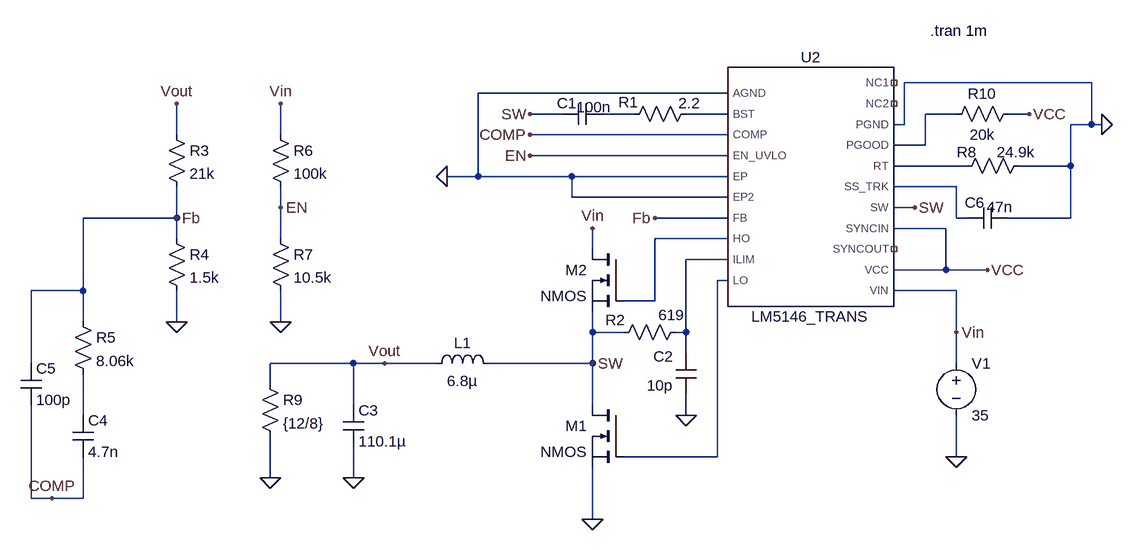
[diagram p0: schematic LM5146.asc]
LM5146.asc, the LTspice schematic file:
Version 4.1
SHEET 1 1416 724
WIRE 592 32 304 32
WIRE 32 48 -352 48
WIRE -224 80 -272 80
WIRE -112 80 -160 80
WIRE 32 80 -32 80
WIRE 384 80 336 80
WIRE 496 80 464 80
WIRE 304 96 304 32
WIRE 304 96 288 96
WIRE 592 96 592 32
WIRE 592 96 560 96
WIRE 608 96 592 96
WIRE -816 112 -816 64
WIRE -656 112 -656 64
WIRE 32 112 -272 112
WIRE 336 128 336 80
WIRE 336 128 288 128
WIRE 32 144 -272 144
WIRE 400 160 288 160
WIRE 560 160 560 96
WIRE 560 160 480 160
WIRE -352 176 -352 48
WIRE -352 176 -400 176
WIRE -208 176 -352 176
WIRE 32 176 -208 176
WIRE 384 192 288 192
WIRE -208 208 -208 176
WIRE 32 208 -208 208
WIRE -656 224 -656 192
WIRE 320 224 288 224
WIRE -816 240 -816 192
WIRE -816 240 -960 240
WIRE 32 240 -80 240
WIRE 384 240 384 192
WIRE 400 240 384 240
WIRE 560 240 560 160
WIRE 560 240 464 240
WIRE 368 256 288 256
WIRE -816 272 -816 240
WIRE -656 272 -656 224
WIRE 32 272 -80 272
WIRE -176 288 -176 256
WIRE 32 304 -32 304
WIRE 368 320 368 256
WIRE 368 320 288 320
WIRE 432 320 368 320
WIRE 32 336 16 336
WIRE -960 352 -960 240
WIRE -960 352 -1040 352
WIRE 384 352 288 352
WIRE -80 368 -80 272
WIRE -80 368 -128 368
WIRE -960 400 -960 352
WIRE -816 400 -816 352
WIRE -656 400 -656 352
WIRE -176 416 -176 384
WIRE -128 416 -176 416
WIRE -32 416 -32 304
WIRE -32 416 -48 416
WIRE 384 416 384 352
WIRE -32 448 -32 416
WIRE -1040 464 -1040 352
WIRE -544 464 -672 464
WIRE -496 464 -544 464
WIRE -416 464 -496 464
WIRE -176 464 -176 416
WIRE -176 464 -336 464
WIRE 384 464 384 416
WIRE -672 496 -672 464
WIRE -544 528 -544 464
WIRE -176 528 -176 464
WIRE -960 544 -960 480
WIRE -32 544 -32 512
WIRE 16 608 16 336
WIRE 16 608 -128 608
WIRE 384 608 384 544
WIRE -672 640 -672 576
WIRE -544 640 -544 592
WIRE -1040 672 -1040 528
WIRE -1008 672 -1040 672
WIRE -960 672 -960 608
WIRE -960 672 -1008 672
WIRE -176 704 -176 624
FLAG -400 176 0
FLAG 608 96 0
FLAG -272 80 SW
FLAG 432 320 VCC
FLAG 384 608 0
FLAG 384 416 Vin
FLAG -176 256 Vin
FLAG -176 704 0
FLAG -32 544 0
FLAG -544 640 0
FLAG -496 464 Vout
FLAG -816 400 0
FLAG -816 64 Vout
FLAG -816 240 Fb
FLAG -80 240 Fb
FLAG -1008 672 COMP
FLAG -272 112 COMP
FLAG -656 400 0
FLAG -656 64 Vin
FLAG -656 224 EN
FLAG -272 144 EN
FLAG 320 224 SW
FLAG -176 464 SW
FLAG -672 640 0
FLAG 496 80 VCC
SYMBOL res -16 64 R90
WINDOW 0 13 105 VBottom 2
WINDOW 3 -16 11 VTop 2
SYMATTR InstName R1
SYMATTR Value 2.2
SYMBOL cap -160 64 R90
WINDOW 0 15 55 VBottom 2
WINDOW 3 -10 14 VTop 2
SYMATTR InstName C1
SYMATTR Value 100n
SYMBOL voltage 384 448 R0
WINDOW 123 0 0 Left 0
WINDOW 39 0 0 Left 0
SYMATTR InstName V1
SYMATTR Value 35
SYMBOL nmos -128 528 M0
SYMATTR InstName M1
SYMBOL nmos -128 288 M0
SYMATTR InstName M2
SYMBOL res -32 400 R90
WINDOW 0 13 109 VBottom 2
WINDOW 3 -26 22 VTop 2
SYMATTR InstName R2
SYMATTR Value 619
SYMBOL cap -48 448 R0
WINDOW 0 -34 5 Left 2
WINDOW 3 -44 50 Left 2
SYMATTR InstName C2
SYMATTR Value 10p
SYMBOL ind -432 480 R270
WINDOW 0 32 56 VTop 2
WINDOW 3 5 56 VBottom 2
SYMATTR InstName L1
SYMATTR Value 6.8µ
SYMBOL cap -560 528 R0
SYMATTR InstName C3
SYMATTR Value 110.1µ
SYMBOL res -832 96 R0
SYMATTR InstName R3
SYMATTR Value 21k
SYMBOL res -832 256 R0
SYMATTR InstName R4
SYMATTR Value 1.5k
SYMBOL res -976 384 R0
SYMATTR InstName R5
SYMATTR Value 8.06k
SYMBOL cap -976 544 R0
SYMATTR InstName C4
SYMATTR Value 4.7n
SYMBOL cap -1056 464 R0
SYMATTR InstName C5
SYMATTR Value 100p
SYMBOL res -672 96 R0
SYMATTR InstName R6
SYMATTR Value 100k
SYMBOL res -672 256 R0
SYMATTR InstName R7
SYMATTR Value 10.5k
SYMBOL res 496 144 R90
WINDOW 0 10 96 VBottom 2
WINDOW 3 -21 20 VTop 2
SYMATTR InstName R8
SYMATTR Value 24.9k
SYMBOL cap 464 224 R90
WINDOW 0 8 52 VBottom 2
WINDOW 3 -16 13 VTop 2
SYMATTR InstName C6
SYMATTR Value 47n
SYMBOL res -688 480 R0
SYMATTR InstName R9
SYMATTR Value {12/8}
SYMBOL LM5146 160 192 R0
SYMATTR InstName U2
SYMBOL res 480 64 R90
WINDOW 0 0 56 VBottom 2
WINDOW 3 32 56 VTop 2
SYMATTR InstName R10
SYMATTR Value 20k
TEXT 344 -48 Left 2 !.tran 1m

The netlist it stands for:
* LM5146.asc
R1 N002 N001 2.2
C1 N001 SW 100n
V1 Vin 0 35
M1 SW N008 0 0 NMOS
M2 Vin N006 SW SW NMOS
R2 N007 SW 619
C2 N007 0 10p
L1 Vout SW 6.8µ
C3 Vout 0 110.1µ
R3 Vout Fb 21k
R4 Fb 0 1.5k
R5 Fb N009 8.06k
C4 N009 COMP 4.7n
C5 Fb COMP 100p
R6 Vin EN 100k
R7 EN 0 10.5k
R8 0 N004 24.9k
C6 0 N005 47n
R9 Vout 0 {12/8}
X§U2 0 N002 COMP EN 0 0 Fb N006 N007 N008 NC_01 NC_02 0 N003 N004 N005 SW VCC NC_03 VCC Vin LM5146_TRANS  ; pins AGND BST COMP EN_UVLO EP EP2 FB HO ILIM LO NC1 NC2 PGND PGOOD RT SS_TRK SW SYNCIN SYNCOUT VCC VIN
R10 VCC N003 20k
.model NMOS NMOS
.model PMOS PMOS
.lib standard.mos
.tran 1m
.lib LM5146_TRANS.lib
.backanno
.end